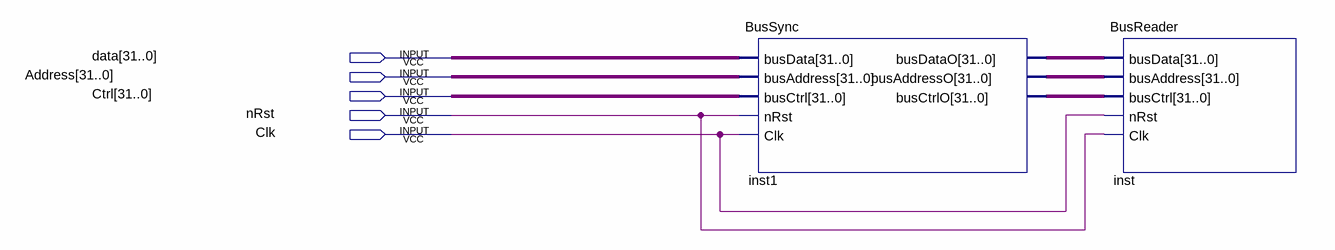
[diagram p0: schematic sheet]
// Quartus schematic debug.bdf as structural Verilog: 2 symbols, 5 pins
module debug (
  input  [31:0] data,
  input  [31:0] Address,
  input  [31:0] Ctrl,
  input  nRst,
  input  Clk
);

  wire [31:0] inst1_busaddresso, inst1_busctrlo, inst1_busdatao;

  BusSync inst1 (
    .busData(data), .busAddress(Address), .busCtrl(Ctrl), .nRst(nRst), .Clk(Clk), .busDataO(inst1_busdatao),
    .busAddressO(inst1_busaddresso), .busCtrlO(inst1_busctrlo));
  BusReader inst (
    .busData(inst1_busdatao), .busAddress(inst1_busaddresso), .busCtrl(inst1_busctrlo), .nRst(Clk), .Clk(nRst));
endmodule
